# Altium schematic sheet nRF52_bluetooh.SchDoc: Arkusz główny
size A4; ProjectNumber: 4397; PCBRevision: 0068KJP; DocumentSize: A4; PCAName: PCA10036; PCBNumber: 400118; Date: 23-02-2017; Author: Mateusz Gancarczyk; Revision: ver 2.0; SheetNumber: 2; SheetTotal: 2; PageSetup: Record=PageOptions|CenterHorizontal=True|CenterVertical=True|PrintScale=1.00|XCorrection=1.00|YCorrection=1.00|PrintKind=0|BorderSize=5000000|LeftOffset=0|BottomOffset=0|Orientation=2|PaperLength=1000|PaperWidth=1000|Scale=100|PaperSource=7|PrintQuality=-4|MediaType=1|DitherType=10|PaperKind=A3 (297 x 420 mm)|PrintScaleMode=0; NameOfProject: Smart Flower Pot; NameOfSheet: Bluetooth nRF52832; ProjectName: Projekt XXX
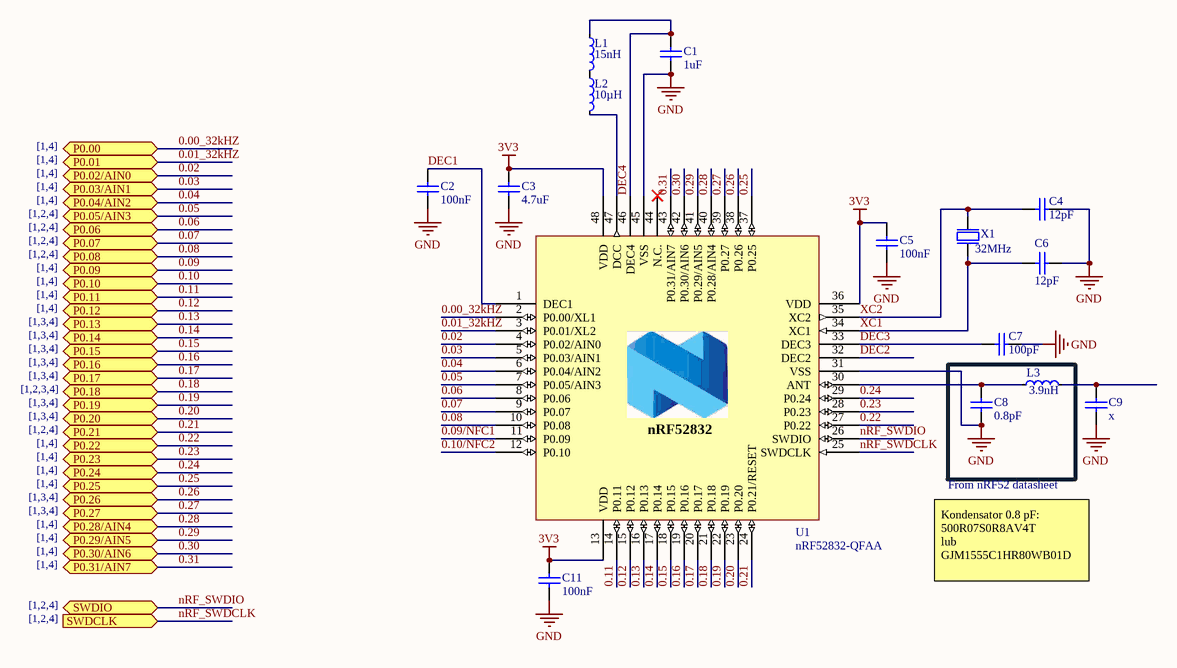
[diagram p0: nRF52_bluetooh.SchDoc]

## Parts
C1  Wartość: 1uF  [0603C-GENERIC]  (hidden comment: 0603 1uF 10V)
C2  Wartość: 100nF  [0603C-GENERIC]  (hidden comment: 0603 100nF 10V)
C3  Wartość: 4.7uF  [0603C-GENERIC]  (hidden comment: 0603 4.7uF 10V)
C4  Wartość: 12pF  [0603C-GENERIC]  (hidden comment: 0603 12pF 10V)
C5  Wartość: 100nF  [0603C-GENERIC]  (hidden comment: 0603 100nF 10V)
C6  Wartość: 12pF  [0603C-GENERIC]  (hidden comment: 0603 12pF 10V)
C7  Wartość: 100pF  [SMD 0402 - capacitor]  (hidden comment: 0402 100pF 10V)
C8  Wartość: 0.8pF  [SMD 0402 - capacitor]  (hidden comment: 0402 0.8pF 10V)
C9  Wartość: x  [SMD 0402 - capacitor]  (hidden comment: 0402 x 10V)
C11  Wartość: 100nF  [0603C-GENERIC]  (hidden comment: 0603 100nF 10V)
L1  value 15nH  [INDC1005X04L]  (hidden comment: HK100515NJ-T)
L2  value 10µH  [INDC1608X06L]  (hidden comment: LBMF1608T100K)
L3  value 3.9nH  [INDC1005X04L]  (hidden comment: LQP15MN3N9B02D)
U1  nRF52832-QFAA  [QFN40P600X600X90-48N]
X1  value 32MHz  [BT-XTAL_2016]  (hidden comment: Q22FA1280034112 lub 774-402F16011CAT)

## Ports
P0.00 (bidir), P0.01 (bidir), P0.02/AIN0 (bidir), P0.03/AIN1 (bidir), P0.04/AIN2 (bidir), P0.05/AIN3 (bidir), P0.06 (bidir), P0.07 (bidir), P0.08 (bidir), P0.09 (bidir), P0.10 (bidir), P0.11 (bidir), P0.12 (bidir), P0.13 (bidir), P0.14 (bidir), P0.15 (bidir), P0.16 (bidir), P0.17 (bidir), P0.18 (bidir), P0.19 (bidir), P0.20 (bidir), P0.21 (bidir), P0.22 (bidir), P0.23 (bidir), P0.24 (bidir), P0.25 (bidir), P0.26 (bidir), P0.27 (bidir), P0.28/AIN4 (bidir), P0.29/AIN5 (bidir), P0.30/AIN6 (bidir), P0.31/AIN7 (bidir), SWDCLK (in), SWDIO (bidir)

## Nets
3V3: C3.1 C5.1 C11.1 U1.13(VDD) U1.36(VDD) U1.48(VDD)
GND: C1.2 C2.2 C3.2 C4.1 C5.2 C6.1 C7.1 C8.2 C9.2 C11.2 U1.31(VSS) U1.45(VSS) U1.49(GND) X1.2(GND) X1.4(GND)
0.00_32kHZ: U1.2(P0.00/XL1) ; port P0.00
0.01_32kHZ: U1.3(P0.01/XL2) ; port P0.01
0.02: U1.4(P0.02/AIN0) ; port P0.02/AIN0
0.03: U1.5(P0.03/AIN1) ; port P0.03/AIN1
0.04: U1.6(P0.04/AIN2) ; port P0.04/AIN2
0.05: U1.7(P0.05/AIN3) ; port P0.05/AIN3
0.06: U1.8(P0.06) ; port P0.06
0.07: U1.9(P0.07) ; port P0.07
0.08: U1.10(P0.08) ; port P0.08
0.09: port P0.09
0.09/NFC1: U1.11(P0.09)
0.10: port P0.10
0.10/NFC2: U1.12(P0.10)
0.11: U1.14(P0.11) ; port P0.11
0.12: U1.15(P0.12) ; port P0.12
0.13: U1.16(P0.13) ; port P0.13
0.14: U1.17(P0.14) ; port P0.14
0.15: U1.18(P0.15) ; port P0.15
0.16: U1.19(P0.16) ; port P0.16
0.17: U1.20(P0.17) ; port P0.17
0.18: U1.21(P0.18) ; port P0.18
0.19: U1.22(P0.19) ; port P0.19
0.20: U1.23(P0.20) ; port P0.20
0.21: U1.24(P0.21/RESET) ; port P0.21
0.22: U1.27(P0.22) ; port P0.22
0.23: U1.28(P0.23) ; port P0.23
0.24: U1.29(P0.24) ; port P0.24
0.25: U1.37(P0.25) ; port P0.25
0.26: U1.38(P0.26) ; port P0.26
0.27: U1.39(P0.27) ; port P0.27
0.28: U1.40(P0.28/AIN4) ; port P0.28/AIN4
0.29: U1.41(P0.29/AIN5) ; port P0.29/AIN5
0.30: U1.42(P0.30/AIN6) ; port P0.30/AIN6
0.31: U1.43(P0.31/AIN7) ; port P0.31/AIN7
DEC1: C2.1 U1.1(DEC1)
DEC2: U1.32(DEC2)
DEC3: C7.2 U1.33(DEC3)
DEC4: C1.1 L1.1 U1.46(DEC4)
nRF_SWDCLK: U1.25(SWDCLK) ; port SWDCLK
nRF_SWDIO: U1.26(SWDIO) ; port SWDIO
XC1: C6.2 U1.34(XC1) X1.1(inp)
XC2: C4.2 U1.35(XC2) X1.3(out)
NetC8_1: C8.1 L3.1 U1.30(ANT)
NetC9_1: C9.1 L3.2
NetL1_2: L1.2 L2.1
NetL2_2: L2.2 U1.47(DCC)

Not connected (* = marked no-connect by the designer): U1 44(N.C.)*

## Notes on the sheet
- [1,4]
- [1,2,4]
- [1,3,4]
- [1,2,3,4]
- From nRF52 datasheet
- Kondensator 0.8 pF:
  500R07S0R8AV4T
  lub
  GJM1555C1HR80WB01D
- Author:
- Sheet:
- /
- Issue date:
- Project name:
- Date:
- Revision:
- Page name:
- (in symbol nRF52832-QFAA) nRF52832

## Library data of the parts
C1-C9 C11 = Kondensator SMD: Kondensator
L1 = L0402-15n: Dławik 15nH; Manufacturer: Taiyo Yuden; 2nd source part number: 658-1328; Note: High frequency chip inductor ±10%; Artikkelnr Noca: 33029323; Artikkelnr Simpro: N.A.; Part Number: L0402-15n; Manufacturer Part Number: HK100515NJ-T; LatestRevisionDate: 2012-09-19; Pin Count: 2; Publisher: Nordic Semiconductor; Published: 2010-07-12; Supplier: Digi-Key; Datasheet: http://www.yuden.co.jp/productdata/catalog/en/mlci04_e.pdf; Supplier part number: 587-1521-1-ND; 2nd source Supplier: Farnell; Footprint Doc: 0402
L2 = L0603-10µ: Dławik 10uH; Manufacturer: Taiyo Yuden; 2nd source part number: 178-6105; Note: LBMF1608T100K 10µH 80mA 0603; Artikkelnr Noca: 33029314; Artikkelnr Simpro: N.A.; Part Number: L0603-10µ; Manufacturer Part Number: LBMF1608T100K; Datasheet: http://www.yuden.co.jp/ut/product/pdf/elb2_e.pdf; LatestRevisionDate: 2012-09-19; Pin Count: 2; Publisher: Nordic Semiconductor; Published: 2010-02-24; Supplier: Digi-Key; Supplier part number: 587-1714-1-ND; 2nd source Supplier: Farnell; Footprint Doc: 0603
L3 = L0402-3n9: Dławik 3,9nH; Manufacturer: Murata; Note: High frequency chip inductor ±5%; Artikkelnr Noca: 33029151; Artikkelnr Simpro: N.A.; Part Number: L0402-3n9; Manufacturer Part Number: LQP15MN3N9B02D; Datasheet: http://search.murata.co.jp/Ceramy/image/img/PDF/ENG/L0075S0084LQP15M.pdf; LatestRevisionDate: 2012-09-19; Pin Count: 2; Publisher: Nordic Semiconductor; Published: 2009-05-08; Supplier: Digi-Key; Supplier part number: 490-1131-1-ND; 2nd source Supplier: *; 2nd source part number: *; Footprint Doc: 0402
U1 = nRF52832-QFAA: Multi-protocol Bluetooth Low Energy and 2.4GHz proprietary system-on-chip; Manufacturer: Nordic Semiconductor; Artikkelnr Noca: N.A.; Part Number: nRF52832-QFAA; Manufacturer Part Number: nRF52832-QFAA; Datasheet: *; LatestRevisionDate: 2014-11-26; Pin Count: 48; Publisher: Nordic Semiconductor; Published: 2014-11-26; Value: nRF52832-QFAA; Note: *; Supplier: Nordic Semiconductor; Supplier part number: *; 2nd source Supplier: *; 2nd source part number: *; Footprint Doc: QFN-48; Artikkelnr Simpro: N.A.
X1 = XTAL_SMD2016_32MHz_8pF_Epson: Kwarc 32MHz; Manufacturer: Epson Toyocom; Manufacturer Part Number: Q22FA12800025; Note: XTAL SMD 32.000MHz; Artikkelnr Noca: N.A.; Part Number: XTAL_SMD2016_32MHz_8pF_Epson; Datasheet: http://www.epsondevice.com/docs/qd/en/DownloadServlet?id=ID000449; LatestRevisionDate: 2014-11-27; Pin Count: 4; Publisher: Nordic Semiconductor; Published: 2012-03-09; Supplier: Farnell; Supplier part number: 171-2806; 2nd source Supplier: *; 2nd source part number: *; Footprint Doc: XTAL_2016; Artikkelnr Simpro: N.A.